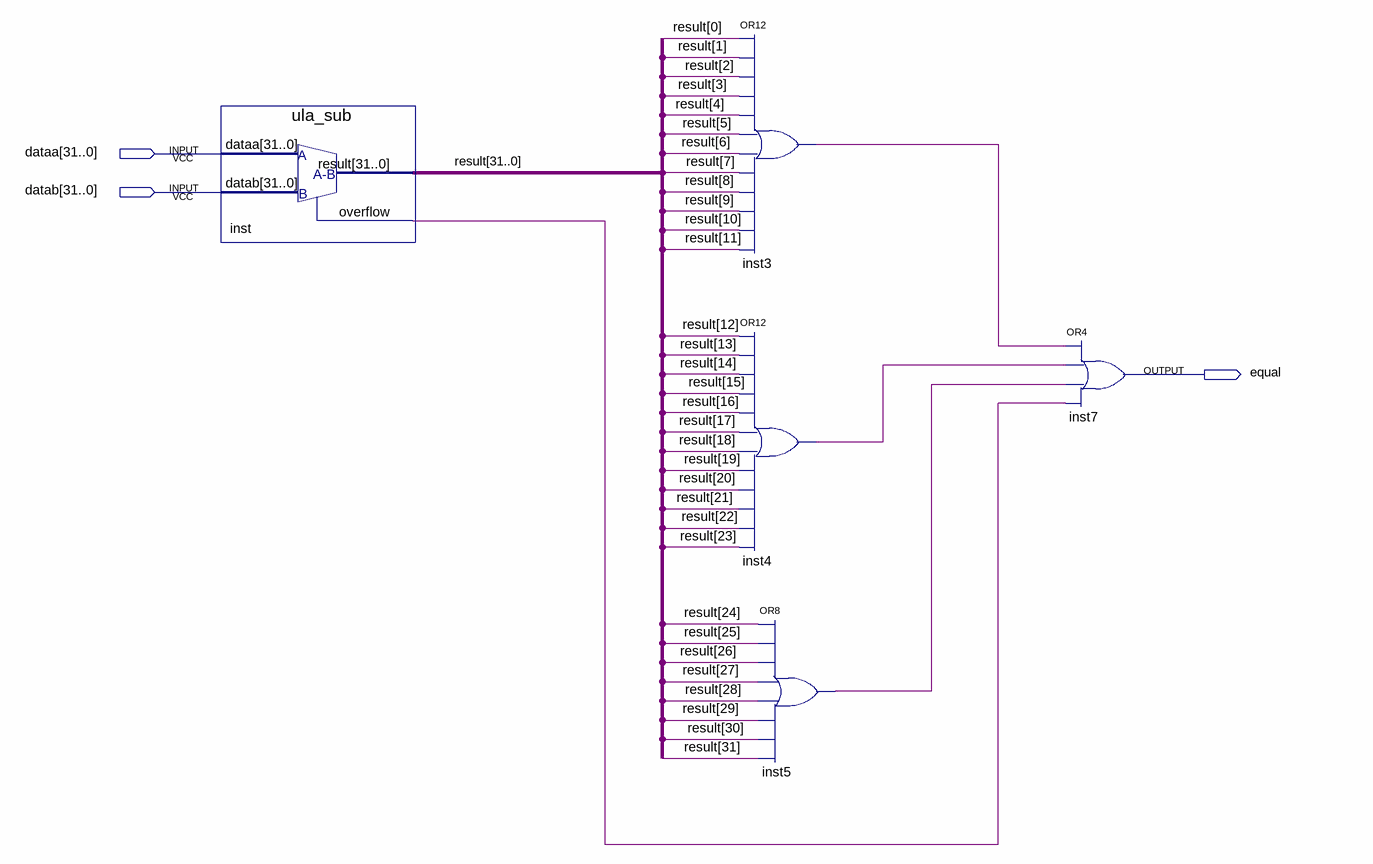
[diagram p0: schematic sheet]
// Quartus schematic equal32.bdf as structural Verilog: 5 symbols, 3 pins
module equal32 (
  input  [31:0] dataa,
  input  [31:0] datab,
  output equal
);

  wire inst3_out, inst4_out, inst5_out, inst_overflow;
  wire [31:0] result;

  ula_sub inst (.dataa(dataa), .datab(datab), .result(result), .overflow(inst_overflow));
  or inst3 (inst3_out, result[0], result[1], result[2], result[3], result[4], result[5], result[6], result[7], result[8], result[9], result[10], result[11]);
  or inst4 (inst4_out, result[12], result[13], result[14], result[15], result[16], result[17], result[18], result[19], result[20], result[21], result[22], result[23]);
  or inst5 (inst5_out, result[24], result[25], result[26], result[27], result[28], result[29], result[30], result[31]);
  or inst7 (equal, inst3_out, inst4_out, inst5_out, inst_overflow);
endmodule
